# Altium schematic sheet Connectors.SchDoc
size A4
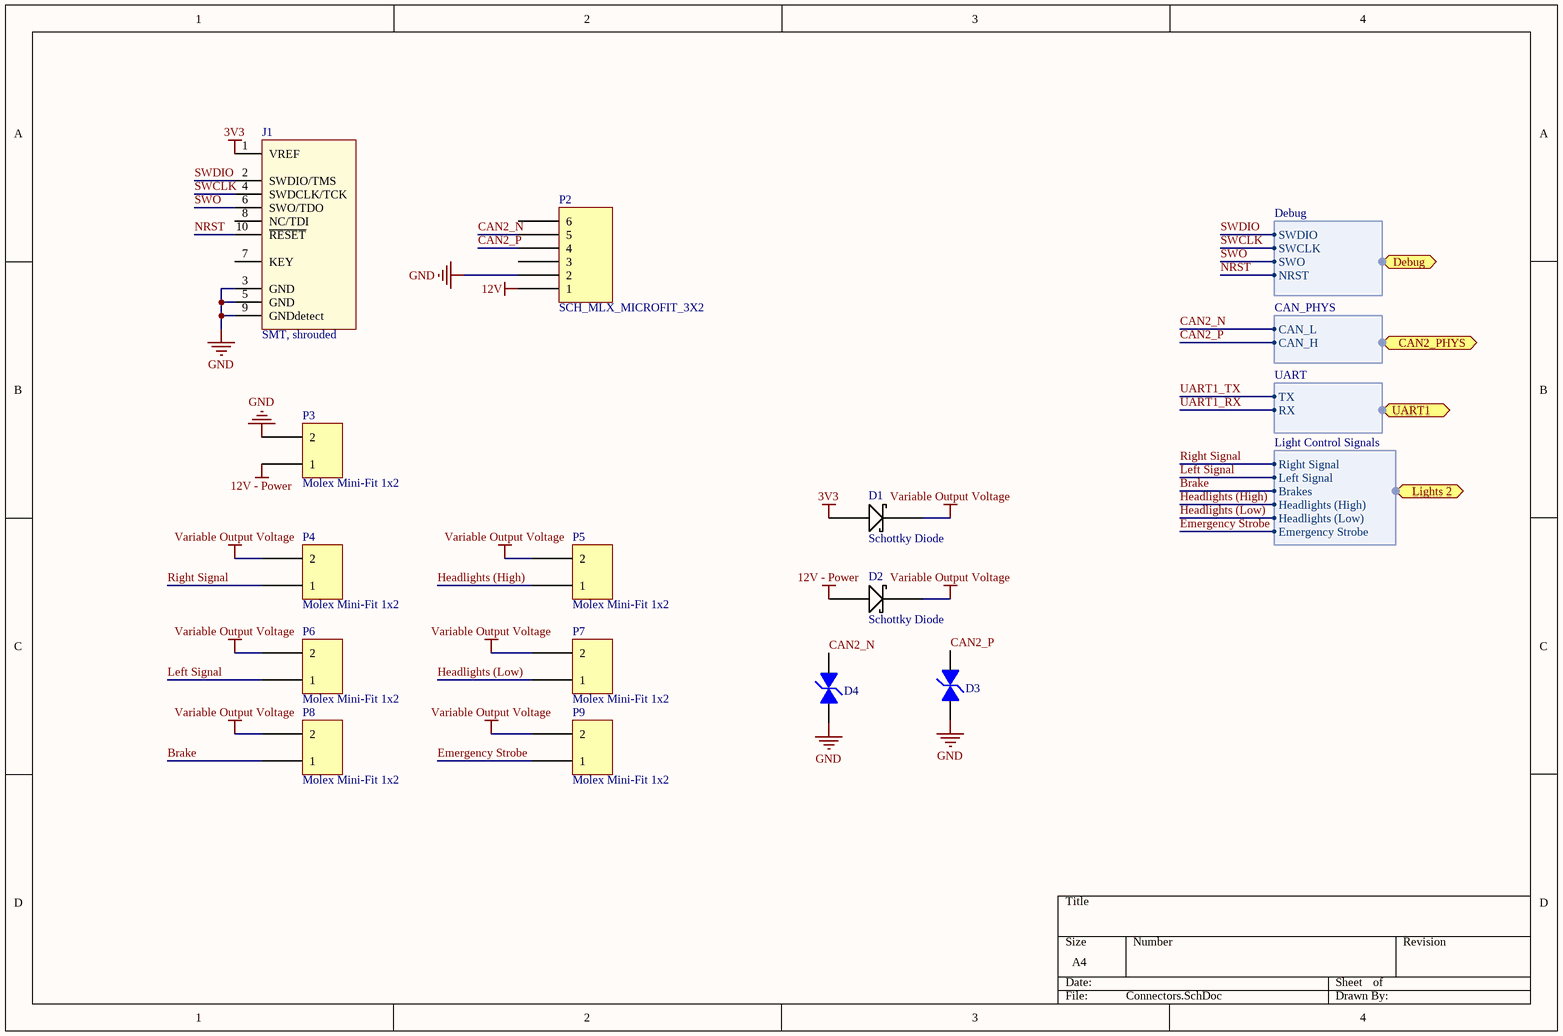
[diagram p0: Connectors.SchDoc]

## Parts
D1  Schottky Diode  [ON Semi Schottky Diode - MBRM110LT1G]
D2  Schottky Diode  [ON Semi Schottky Diode - MBRM110LT1G]
D3  TVS Diode  [TVS Diode]  (value not drawn)
D4  TVS Diode  [TVS Diode]  (value not drawn)
J1  SMT, shrouded  [CONN-50mil-10POS-SMD]
P2  SCH_MLX_MICROFIT_3X2  [PCB_MLX_MICROFIT_3X2]
P3  Molex Mini-Fit 1x2  [Molex Mini-Fit Jr 2x1]
P4  Molex Mini-Fit 1x2  [Molex Mini-Fit Jr 2x1]
P5  Molex Mini-Fit 1x2  [Molex Mini-Fit Jr 2x1]
P6  Molex Mini-Fit 1x2  [Molex Mini-Fit Jr 2x1]
P7  Molex Mini-Fit 1x2  [Molex Mini-Fit Jr 2x1]
P8  Molex Mini-Fit 1x2  [Molex Mini-Fit Jr 2x1]
P9  Molex Mini-Fit 1x2  [Molex Mini-Fit Jr 2x1]

## Ports
CAN2_PHYS (harness CAN_PHYS), Debug (harness Debug), Lights 2 (harness Light Control Signals), UART1 (harness UART)

## Harnesses
Debug: SWDIO, SWCLK, SWO, NRST
CAN_PHYS: CAN_L, CAN_H
UART: TX, RX
Light Control Signals: Right Signal, Left Signal, Brakes, Headlights (Low), Headlights (High), Emergency Strobe

## Nets
3V3: D1.2 J1.1(VREF)
12V: P2.1
12V - Power: D2.2 P3.1
GND: D3.2 D4.2 J1.3(GND) J1.5(GND) J1.9(GNDdetect) P2.2 P3.2
Variable Output Voltage: D1.1 D2.1 P4.2 P5.2 P6.2 P7.2 P8.2 P9.2
Brake: P8.1 ; port Lights 2.Brakes
CAN2_N: D4.1 P2.5 ; port CAN2_PHYS.CAN_L
CAN2_P: D3.1 P2.4 ; port CAN2_PHYS.CAN_H
Emergency Strobe: P9.1 ; port Lights 2.Emergency Strobe
Headlights (High): P5.1 ; port Lights 2.Headlights (High)
Headlights (Low): P7.1 ; port Lights 2.Headlights (Low)
Left Signal: P6.1 ; port Lights 2.Left Signal
NRST: J1.10(~{RESET}) ; port Debug.NRST
Right Signal: P4.1 ; port Lights 2.Right Signal
SWCLK: J1.4(SWDCLK/TCK) ; port Debug.SWCLK
SWDIO: J1.2(SWDIO/TMS) ; port Debug.SWDIO
SWO: J1.6(SWO/TDO) ; port Debug.SWO
UART1_RX: port UART1.RX
UART1_TX: port UART1.TX

Not connected (* = marked no-connect by the designer): J1 7(KEY) 8(NC/TDI); P2 3 6

## Library data of the parts
D1 D2 = ON Semi Schottky Diode - MBRM110LT1G
D3 D4 = TVS Diode: Manufacturer: Bourns; Manufacturer ID: CDSOD323-T03SC
J1 = conn_0.050"_cortexM: ARM Cortex-M 10pin connector,shrouded,SMT; Supplier 1: Digi-Key; Supplier Part Number 1: 1175-1629-ND